# EAGLE design LiPoCharger (EAGLE 5.11)
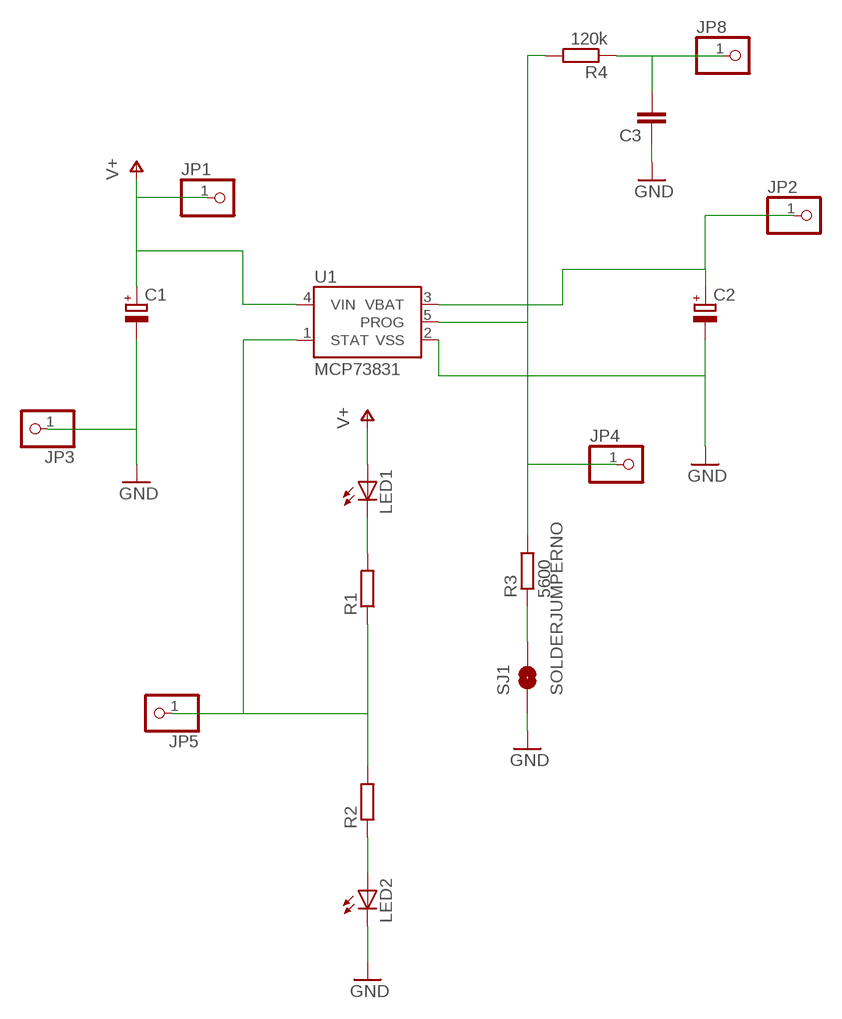
[diagram p0: schematic, sheet 1]

## Parts
C1  CPOL-EUE2.5-6  [E2,5-6]
C2  CPOL-EUE2.5-6  [E2,5-6]
C3  C-EUC1206  [C1206]
JP1  PINHD-1X1  [1X01]
JP2  PINHD-1X1  [1X01]
JP3  PINHD-1X1  [1X01]
JP4  PINHD-1X1  [1X01]
JP5  PINHD-1X1  [1X01]
JP8  PINHD-1X1  [1X01]
LED1  LED5MM  [LED5MM]
LED2  LED5MM  [LED5MM]
R1  R-EU_R0402  [R0402]
R2  R-EU_R0402  [R0402]
R3  5600  R-EU_R0402  [R0402]
R4  120k  R-EU_R0402  [R0402]
SJ1  SOLDERJUMPERNO  [SJ_2S-NO]
U1  MCP73831  [SOT23-5]

## Nets
GND: C1.- C2.- C3.1 JP3.1 LED2.K(C) SJ1.1 U1.2(VSS)
N$1: LED1.K(C) R1.2
N$2: LED2.A R2.1
N$3: JP5.1 R1.1 R2.2 U1.1(STAT)
N$4: JP4.1 R3.2 R4.2 U1.5(PROG)
N$5: C3.2 JP8.1 R4.1
N$6: R3.1 SJ1.2
V+: C1.+ JP1.1 LED1.A U1.4(VIN)
VBATT: C2.+ JP2.1 U1.3(VBAT)

## Library data of the parts
C1 C2 = rcl:CPOL-EU: POLARIZED CAPACITOR, European symbol
C3 = rcl:C-EU: CAPACITOR, European symbol
JP1-JP5 JP8 = pinhead:PINHD-1X1: PIN HEADER
LED1 LED2 = led:LED: LED OSRAM: - CHIPLED LG R971, LG N971, LY N971, LG Q971, LY Q971, LO R971, LY R971 LH N974, LH R974 LS Q976, LO Q976, LY Q976 LO Q996 - Hyper CHIPLED LW Q18S LB Q993, LB Q99A, LB R99A - SideLED LS A670, LO A670, LY A670, LG A670, LP A670 LB A673, LV A673, LT A673, LW A673 LH A674 LY A675 LS A676, LA A676, LO A676, LY A676, LW A676 LS A679, LY A679, LG A679 - Hyper Micro SIDELED® LS Y876, LA Y876, LO Y876, LY Y876 LT Y87S - SmartLED LW L88C, LW L88S LB L89C, LB L89S, LG L890 LS L89K, LO L89K, LY L89K LS L896, LA L896, LO L896, LY L896 - TOPLED LS T670, LO T670, LY T670, LG T670, LP T670 LSG T670, LSP T670, LSY T670, LOP T670, LYG T670 LG T671, LOG T671, LSG T671 LB T673, LV T673, LT T673, LW T673 LH T674 LS T676, LA T676, LO T676, LY T676, LB T676, LH T676, LSB T676, LW T676 LB T67C, LV T67C, LT T67C, LS T67K, LO T67K, LY T67K, LW E67C LS E67B, LA E67B, LO E67B, LY E67B, LB E67C, LV E67C, LT E67C LW T67C LS T679, LY T679, LG T679 LS T770, LO T770, LY T770, LG T770, LP T770 LB T773, LV T773, LT T773, LW T773 LH T774 LS E675, LA E675, LY E675, LS T675 LS T776, LA T776, LO T776, LY T776, LB T776 LHGB T686 LT T68C, LB T68C - Hyper Mini TOPLED® LB M676 - Mini TOPLED Santana® LG M470 LS M47K, LO M47K, LY M47K Source: http://www.osram.convergy.de LUXEON: - LUMILED® LXK2-PW12-R00, LXK2-PW12-S00, LXK2-PW14-U00, LXK2-PW14-V00 LXK2-PM12-R00, LXK2-PM12-S00, LXK2-PM14-U00 LXK2-PE12-Q00, LXK2-PE12-R00, LXK2-PE12-S00, LXK2-PE14-T00, LXK2-PE14-U00 LXK2-PB12-K00, LXK2-PB12-L00, LXK2-PB12-M00, LXK2-PB14-N00, LXK2-PB14-P00, LXK2-PB14-Q00 LXK2-PR12-L00, LXK2-PR12-M00, LXK2-PR14-Q00, LXK2-PR14-R00 LXK2-PD12-Q00, LXK2-PD12-R00, LXK2-PD12-S00 LXK2-PH12-R00, LXK2-PH12-S00 LXK2-PL12-P00, LXK2-PL12-Q00, LXK2-PL12-R00 Source: www.luxeon.com KINGBRIGHT: KA-3528ASYC Source: www.kingbright.com
R1-R4 = rcl:R-EU_: RESISTOR, European symbol
SJ1 = SparkFun:SOLDERJUMPER: Solder Jumper Standard SMD solder jumper. Used to automate production. Two varients : Normally Open and Normally Closed are the same, but have different paste layers. NC will have a large amount of paste and should jumper during reflow.
U1 = SparkFun:MCP73831: Microchip's MCP73831 Miniature single cell, fully integrated Li-Ion, Li-polymer charge management controller http://ww1.microchip.com/downloads/en/DeviceDoc/21984a.pdf

## Board
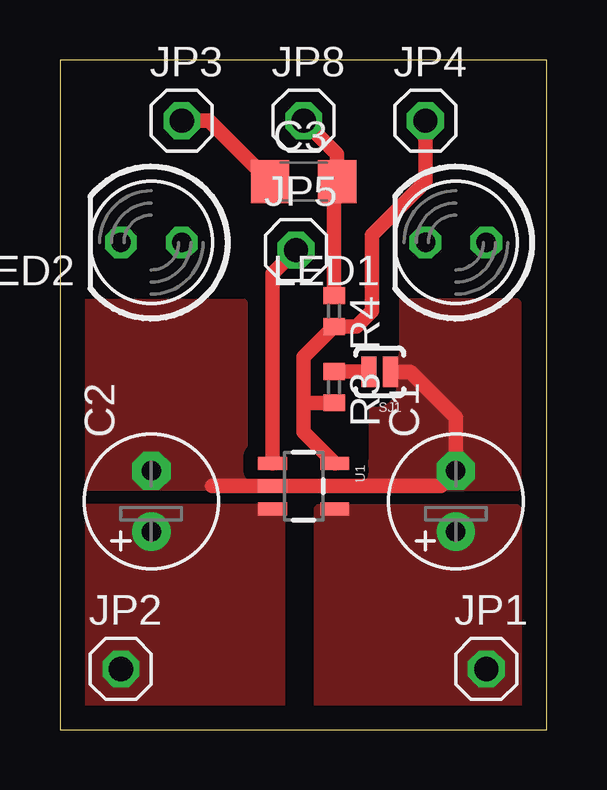
[diagram p1: board, top side]
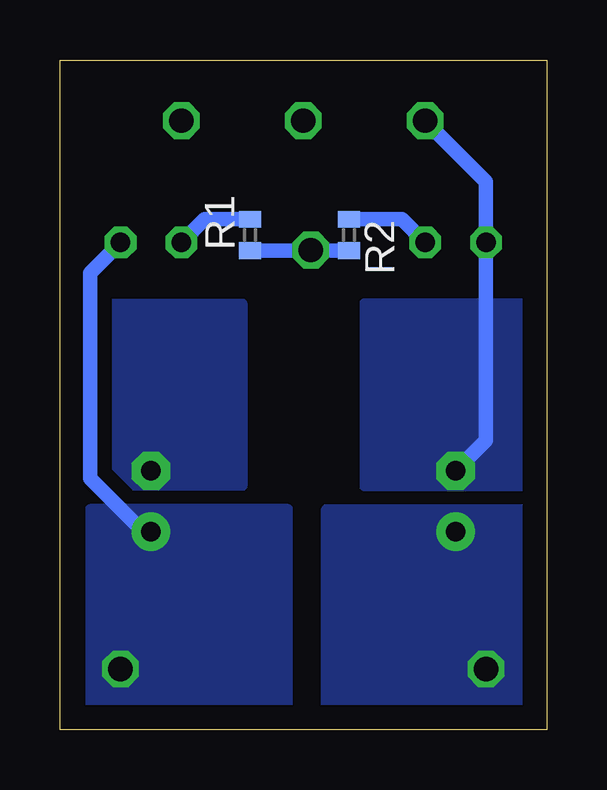
[diagram p2: board, bottom side, seen from below]

Size 20.31 x 27.93 mm. Coordinates in mm from the lower left corner, seen from the top.
Outline: 0,0 20.31,0 20.31,27.93 0,27.93 0,0
Copper layers (1*16): Top 0.035mm / dielectric 1.5mm / Bottom 0.035mm
Design rules "default": minimum track width 10mil, minimum drill 24mil, track to track 8mil, track to pad 8mil, pad to pad 8mil, via to via 8mil, smd to smd 8mil, copper to edge 40mil, drill to drill 8mil, minimum pad ring 10mil, minimum via ring 8mil, stop-mask expansion 4mil, vias tented up to drill 0mil, thermal gap 10mil
tRestrict: area 9.8,11.7 to 12.1,18.1; area 12.1,15.9 to 13.3,18.1

### Footprints (pad centres in the part's own frame; a part is rotated, then mirrored left to right if it is on the bottom)
E2,5-6 = drill 0.813 pad 1.6 round: + -1.27,0 | drill 0.813 pad 1.6 octagon: - 1.27,0
C1206 = smd 1.6 x 1.8: 1 -1.4,0; 2 1.4,0
1X01 = drill 1.016 octagon: 1 0,0
LED5MM = drill 0.813 octagon: A -1.27,0; K 1.27,0
R0402 = smd 0.7 x 0.9: 1 -0.65,0; 2 0.65,0
SJ_2S-NO = smd 0.635 x 1.27: 1 -0.45,0; 2 0.45,0
SOT23-5 = smd 0.55 x 1.2: 1 -0.95,-1.3; 2 0,-1.3; 3 0.95,-1.3; 4 0.95,1.3; 5 -0.95,1.3

### Placement (x,y rotation side)
C1  16.51,9.53 90 top
C2  3.81,9.53 90 top
C3  10.16,22.86 0 top
JP1  17.78,2.54 0 top
JP2  2.54,2.54 0 top
JP3  5.08,25.4 0 top
JP4  15.24,25.4 0 top
JP5  9.84,20 0 top
JP8  10.16,25.4 0 top
LED1  16.51,20.32 180 top
LED2  3.81,20.32 180 top
R1  12.38,20.64 90 bottom
R2  8.26,20.64 270 bottom
R3  11.43,14.29 270 top
R4  11.43,17.46 270 top
SJ1  13.34,14.92 180 top
U1  10.16,10.16 270 top

### Tracks (layer width: path | path; a pad name or v marks a point on that pad's centre or on a via)
GND
  Top 0.61: 6.35,10.16 U1.2 15.88,10.16 C1.- 16.51,13.02 14.61,14.92 SJ1.1 | 8.76,22.99 C3.1 6.22,25.4 JP3.1
  Bottom 0.61: C2.- 2.54,12.06 LED2.K 2.54,22.86 JP3.1
  pour Top (isolate 0.61, no thermals): 0,10.16 0,17.78 7.62,17.78 7.62,10.16
  pour Top (isolate 0.813, no thermals): 19.05,10.16 19.05,17.78 12.7,17.78 12.7,10.16
  pour Bottom (isolate 0.406, no thermals): 0,10.16 0,17.78 7.62,17.78 7.62,10.16
  pour Bottom (isolate 0.61, no thermals): 19.05,10.16 19.05,17.78 12.7,17.78 12.7,10.16
N$1
  Bottom 0.61: R1.2 14.27,21.29 LED1.K
N$2
  Bottom 0.61: R2.1 6.05,21.29 LED2.A
N$3
  Top 0.61: U1.1 8.86,19.02 JP5.1
  Bottom 0.61: R2.2 9.83,19.99 JP5.1 9.86,19.99 R1.1
N$4
  Top 0.61: 10.16,13.64 R3.2 | 10.16,13.64 10.16,15.54 R4.2 12.37,16.81 13.02,17.46 13.02,20.64 15.24,22.86 JP4.1 | 10.16,13.64 10.16,12.41 U1.5
N$5
  Top 0.61: R4.1 11.43,22.73 C3.2 11.56,24 JP8.1
N$6
  Top 0.61: R3.1 12.88,14.94 SJ1.2
V+
  Bottom 0.61: LED1.A 19.05,19.05 19.05,10.48 16.83,8.26 C1.+
  pour Top (no thermals): 19.05,0 10.79,0 10.79,9.21 19.05,9.21
  pour Bottom (no thermals): 19.05,0 10.79,0 10.79,9.21 19.05,9.21
VBATT
  pour Top (no thermals): 0,0 9.21,0 9.21,9.21 0,9.21
  pour Bottom (no thermals): 0,0 9.21,0 9.21,9.21 0,9.21